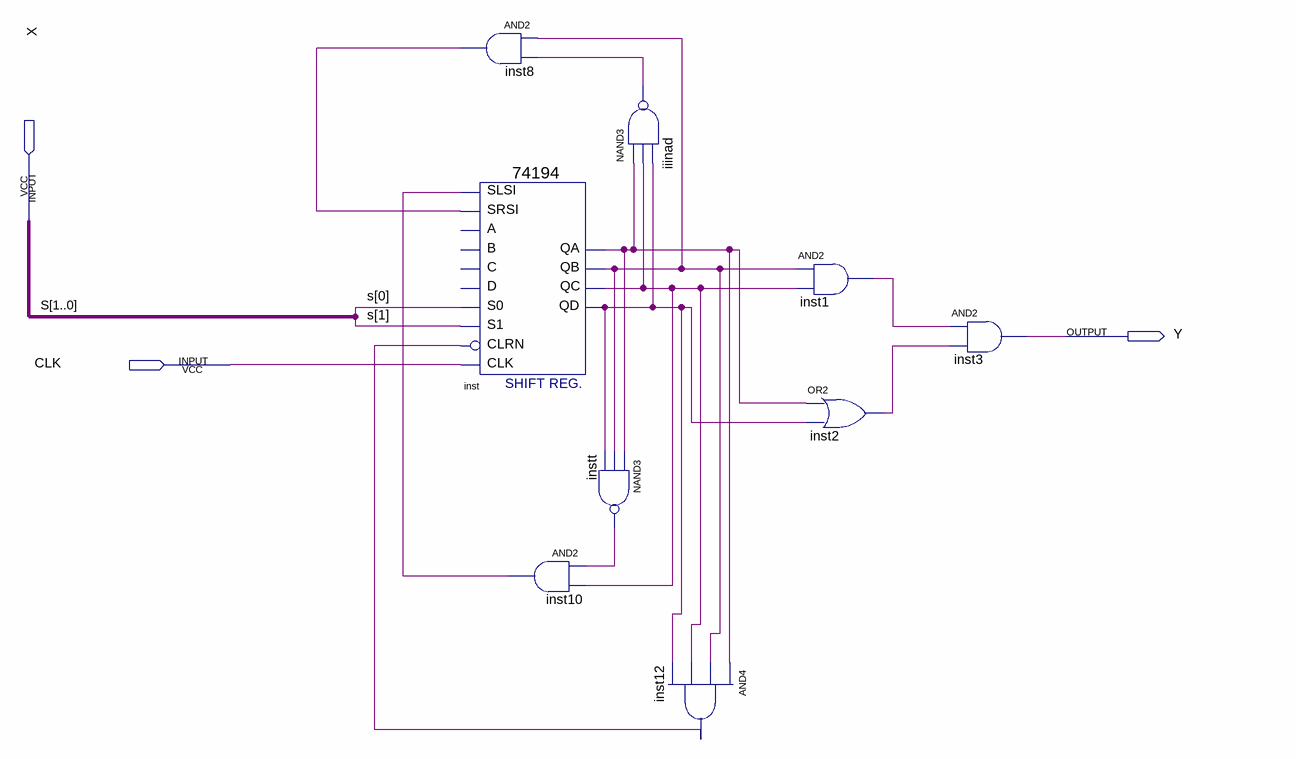
[diagram p0: schematic sheet]
// Quartus schematic DetSeq.bdf as structural Verilog: 9 symbols, 3 pins
module DetSeq (
  input  X,
  input  CLK,
  output Y
);

  wire iiinad_out, inst1_out, inst2_out, inst8_out, inst10_out, inst12_out, inst_qa, inst_qb, inst_qc,
       inst_qd, instt_out;
  wire [1:0] S;

  and inst8 (inst8_out, inst_qb, iiinad_out);
  \74194  inst (
    .SLSI(inst10_out), .SRSI(inst8_out), .CLK(CLK), .CLRN(inst12_out), .S1(S[1]), .S0(S[0]), .QA(inst_qa),
    .QB(inst_qb), .QC(inst_qc), .QD(inst_qd));  // open: B, C, D, A
  and inst10 (inst10_out, instt_out, inst_qc);
  nand instt (instt_out, inst_qa, inst_qb, inst_qd);
  nand iiinad (iiinad_out, inst_qa, inst_qc, inst_qd);
  and inst12 (inst12_out, inst_qa, inst_qb, inst_qc, inst_qd);
  and inst1 (inst1_out, inst_qb, inst_qc);
  or inst2 (inst2_out, inst_qa, inst_qd);
  and inst3 (Y, inst1_out, inst2_out);
endmodule
